# EAGLE design etchasketch (EAGLE 9.6.2)
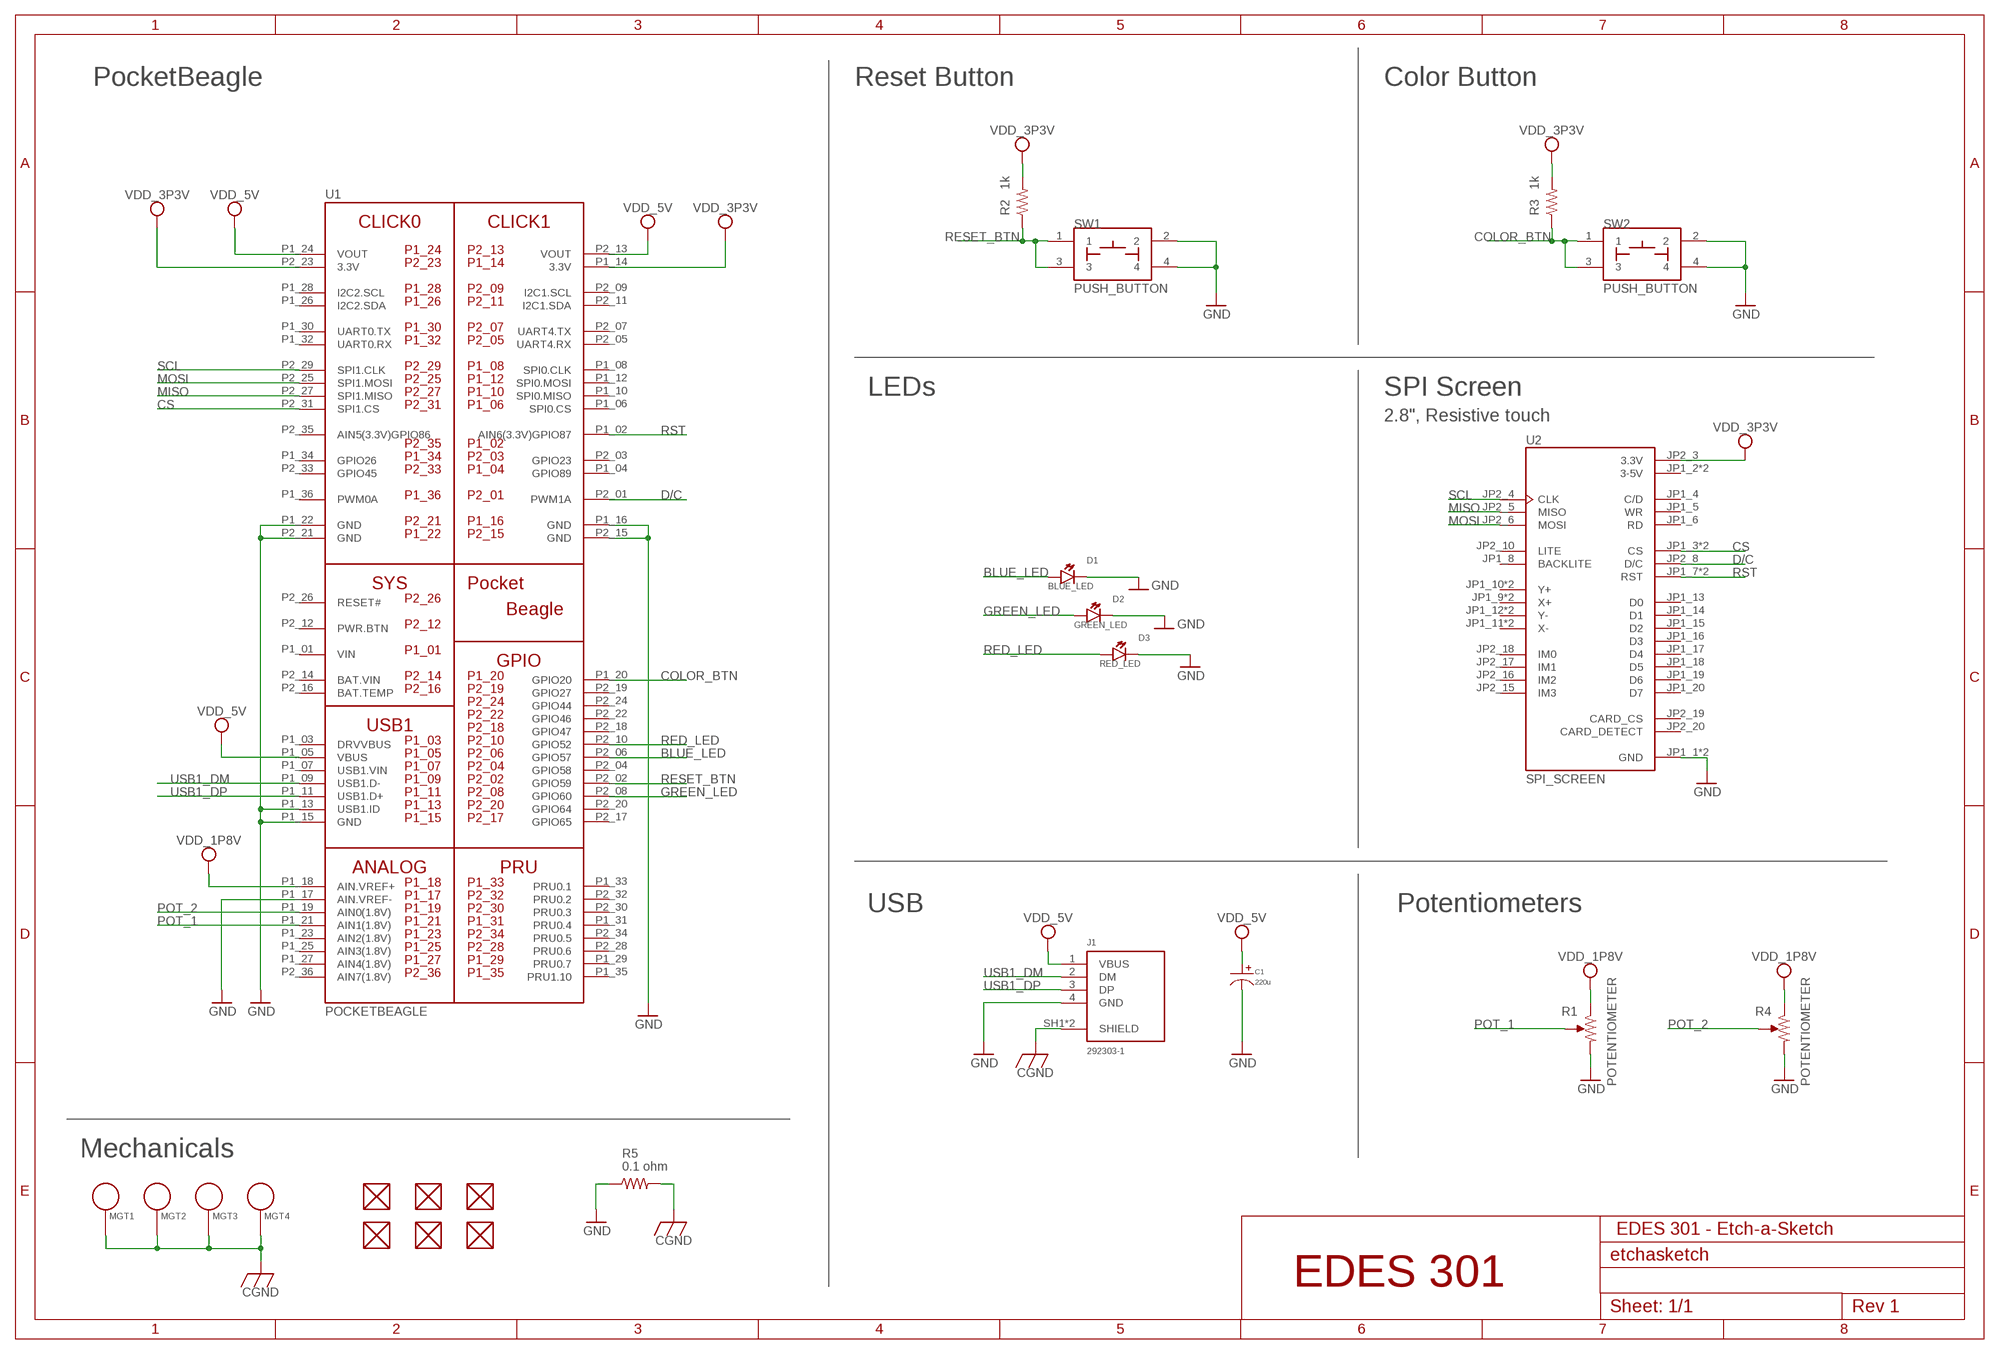
[diagram p0: schematic, sheet 1]

## Parts
C1  220u  CAPACITOR_P_10MM  [CP10MM]
D1  BLUE_LED  LED  [EIA-STD]
D2  GREEN_LED  LED  [EIA-STD]
D3  RED_LED  LED  [EIA-STD]
FUD1  FIDUCIAL  [FIDUCIAL_40MIL]
FUD2  FIDUCIAL  [FIDUCIAL_40MIL]
FUD3  FIDUCIAL  [FIDUCIAL_40MIL]
FUD4  FIDUCIAL  [FIDUCIAL_40MIL]
FUD5  FIDUCIAL  [FIDUCIAL_40MIL]
FUD6  FIDUCIAL  [FIDUCIAL_40MIL]
J1  292303-1  [TE_292303-1]
MGT1  MOUNTING_HOLE  [MOUNTING_HOLE]
MGT2  MOUNTING_HOLE  [MOUNTING_HOLE]
MGT3  MOUNTING_HOLE  [MOUNTING_HOLE]
MGT4  MOUNTING_HOLE  [MOUNTING_HOLE]
R1  POTENTIOMETER  [POT-PO90S]
R2  1k  R_R0603  [R0603]
R3  1k  R_R0603  [R0603]
R4  POTENTIOMETER  [POT-PO90S]
R5  0.1 ohm  R_R0805  [R0805]
SW1  PUSH_BUTTON  [BUTTON_12.5MM]
SW2  PUSH_BUTTON  [BUTTON_12.5MM]
U1  POCKETBEAGLE  [POCKETBEAGLE]
U2  SPI_SCREEN  [MODULE_1770]

## Nets
BLUE_LED: D1.ANODE U1.P2_06(GPIO57)
CGND: J1.SH1(SHIELD) J1.SH2(SHIELD) MGT1.P$1 MGT2.P$1 MGT3.P$1 MGT4.P$1 R5.2
COLOR_BTN: R3.1 SW2.1 SW2.3 U1.P1_20(GPIO20)
CS: U1.P2_31(SPI1.CS) U2.JP1_3(CS) U2.JP2_7(CS)
D/C: U1.P2_01(PWM1A) U2.JP2_8(D/C)
GND: C1.P$2 D1.CATHODE D2.CATHODE D3.CATHODE J1.4(GND) R1.CW R4.CW R5.1 SW1.2 SW1.4 SW2.2 SW2.4 U1.P1_13(USB1.ID) U1.P1_15(GND) U1.P1_16(GND) U1.P1_17(AIN.VREF-) U1.P1_22(GND) U1.P2_15(GND) U1.P2_21(GND) U2.JP1_1(GND) U2.JP2_1(GND)
GREEN_LED: D2.ANODE U1.P2_08(GPIO60)
MISO: U1.P2_27(SPI1.MISO) U2.JP2_5(MISO)
MOSI: U1.P2_25(SPI1.MOSI) U2.JP2_6(MOSI)
POT_1: R1.S U1.P1_21(AIN1(1.8V))
POT_2: R4.S U1.P1_19(AIN0(1.8V))
RED_LED: D3.ANODE U1.P2_10(GPIO52)
RESET_BTN: R2.1 SW1.1 SW1.3 U1.P2_02(GPIO59)
RST: U1.P1_02(AIN6(3.3V)GPIO87) U2.JP1_7(RST) U2.JP2_9(RST)
SCL: U1.P2_29(SPI1.CLK) U2.JP2_4(CLK)
USB1_DM: J1.2(DM) U1.P1_09(USB1.D-)
USB1_DP: J1.3(DP) U1.P1_11(USB1.D+)
VDD_1P8V: R1.CCW R4.CCW U1.P1_18(AIN.VREF+)
VDD_3P3V: R2.2 R3.2 U1.P1_14(3.3V) U1.P2_23(3.3V) U2.JP2_3(3.3V)
VDD_5V: C1.P$1 J1.1(VBUS) U1.P1_05(VBUS) U1.P1_24(VOUT) U1.P2_13(VOUT)
Unconnected: FUD1.P$1 FUD2.P$1 FUD3.P$1 FUD4.P$1 FUD5.P$1 FUD6.P$1 U1.P1_03(DRVVBUS) U1.P1_04(GPIO89) U1.P1_06(SPI0.CS) U1.P1_07(USB1.VIN) U1.P1_08(SPI0.CLK) U1.P1_10(SPI0.MISO) U1.P1_12(SPI0.MOSI) U1.P1_23(AIN2(1.8V)) U1.P1_25(AIN3(1.8V)) U1.P1_26(I2C2.SDA) U1.P1_27(AIN4(1.8V)) U1.P1_28(I2C2.SCL) U1.P1_29(PRU0.7) U1.P1_30(UART0.TX) U1.P1_31(PRU0.4) U1.P1_32(UART0.RX) U1.P1_33(PRU0.1) U1.P1_34(GPIO26) U1.P1_35(PRU1.10) U1.P1_36(PWM0A) U1.P2_03(GPIO23) U1.P2_04(GPIO58) U1.P2_05(UART4.RX) U1.P2_07(UART4.TX) U1.P2_09(I2C1.SCL) U1.P2_11(I2C1.SDA) U1.P2_12(PWR.BTN) U1.P2_16(BAT.TEMP) U1.P2_17(GPIO65) U1.P2_18(GPIO47) U1.P2_19(GPIO27) U1.P2_20(GPIO64) U1.P2_22(GPIO46) U1.P2_24(GPIO44) U1.P2_26(RESET#) U1.P2_28(PRU0.6) U1.P2_30(PRU0.3) U1.P2_32(PRU0.2) U1.P2_33(GPIO45) U1.P2_34(PRU0.5) U1.P2_35(AIN5(3.3V)GPIO86) U1.P2_36(AIN7(1.8V)) U2.JP1_4(C/D) U2.JP1_5(WR) U2.JP1_6(RD) U2.JP1_8(BACKLITE) U2.JP1_9(X+) U2.JP1_10(Y+) U2.JP1_11(X-) U2.JP1_12(Y-) U2.JP1_13(D0) U2.JP1_14(D1) U2.JP1_15(D2) U2.JP1_16(D3) U2.JP1_17(D4) U2.JP1_18(D5) U2.JP1_19(D6) U2.JP1_20(D7) U2.JP2_10(LITE) U2.JP2_11(Y+) U2.JP2_12(X+) U2.JP2_13(Y-) U2.JP2_14(X-) U2.JP2_15(IM3) U2.JP2_16(IM2) U2.JP2_17(IM1) U2.JP2_18(IM0) U2.JP2_19(CARD_CS) U2.JP2_20(CARD_DETECT)

## Notes on the sheet
- PocketBeagle | Reset Button | Color Button
- LEDs | SPI Screen
- 2.8", Resistive touch
- USB | Potentiometers
- Mechanicals
- EDES 301 - Etch-a-Sketch
- EDES 301
- 1/1

## Power pins joined to a net without a drawn wire
3-5V: U2.JP1_2(3-5V) U2.JP2_2(3-5V)
BAT.VIN: U1.P2_14(BAT.VIN)
VIN: U1.P1_01(VIN)

## Library data of the parts
C1 = etchasketch:CAPACITOR_P: Library: MF_Passives Description: Device for Polarized Capacitors. Manufacture part number (MPN), Voltage Rating, and Tolerance can be added via Attributes. Check https://factory.macrofab.com/parts for the house parts list.; POPULATE: 1
D1-D3 = etchasketch:LED: EIA-STD LED, LTST-C191TBKT
FUD1-FUD6 = combo_lock:FIDUCIAL
J1 = etchasketch:292303-1: Check availability <https://pricing.snapeda.com/parts/292303-1/TE%20Connectivity/view-part?ref=eda>; AVAILABILITY: In Stock; CENTERLINE_PITCH: 2 mm[.078 in]; CHECK_PRICES: https://www.snapeda.com/parts/292303-1/TE+Connectivity+AMP+Connectors/view-part/?ref=eda; COMMENT: 292303-1; DESCRIPTION: Type A Standard USB Connector 4 Position Right Angle Mount 1 Port | TE Connectivity 292303-1; EU_ROHS_COMPLIANCE: Compliant; MF: TE Connectivity; MP: 292303-1; NUMBER_OF_POSITIONS: 4; PACKAGE: None; PRICE: None; PRODUCT_TYPE: Connector; SNAPEDA_LINK: https://www.snapeda.com/parts/292303-1/TE+Connectivity+AMP+Connectors/view-part/?ref=snap
MGT1-MGT4 = combo_lock:MOUNTING_HOLE: Chassis Mounting Hole w/GND connection ability
R1 R4 = etchasketch:POTENTIOMETER: Potentiometer - Examples: P090S-14T20BR10K (987-1277-ND)
R2 R3 = etchasketch:R_: RESISTOR, American symbol. 1k
R5 = combo_lock:R_: RESISTOR, American symbol
SW1 SW2 = etchasketch:PUSH_BUTTON
U1 = etchasketch:POCKETBEAGLE
U2 = etchasketch:SPI_SCREEN: Check availability <https://pricing.snapeda.com/parts/1770/Adafruit%20Industries/view-part?ref=eda>; AVAILABILITY: In Stock; CHECK_PRICES: https://www.snapeda.com/parts/1770/Adafruit+Industries/view-part/?ref=eda; DESCRIPTION: 2.8 TFT LCD with Touchscreen Breakout Board w/MicroSD Socket | Adafruit Industries 1770; MF: Adafruit Industries; MP: 1770; PACKAGE: None; PRICE: None; SNAPEDA_LINK: https://www.snapeda.com/parts/1770/Adafruit+Industries/view-part/?ref=snap

## Board
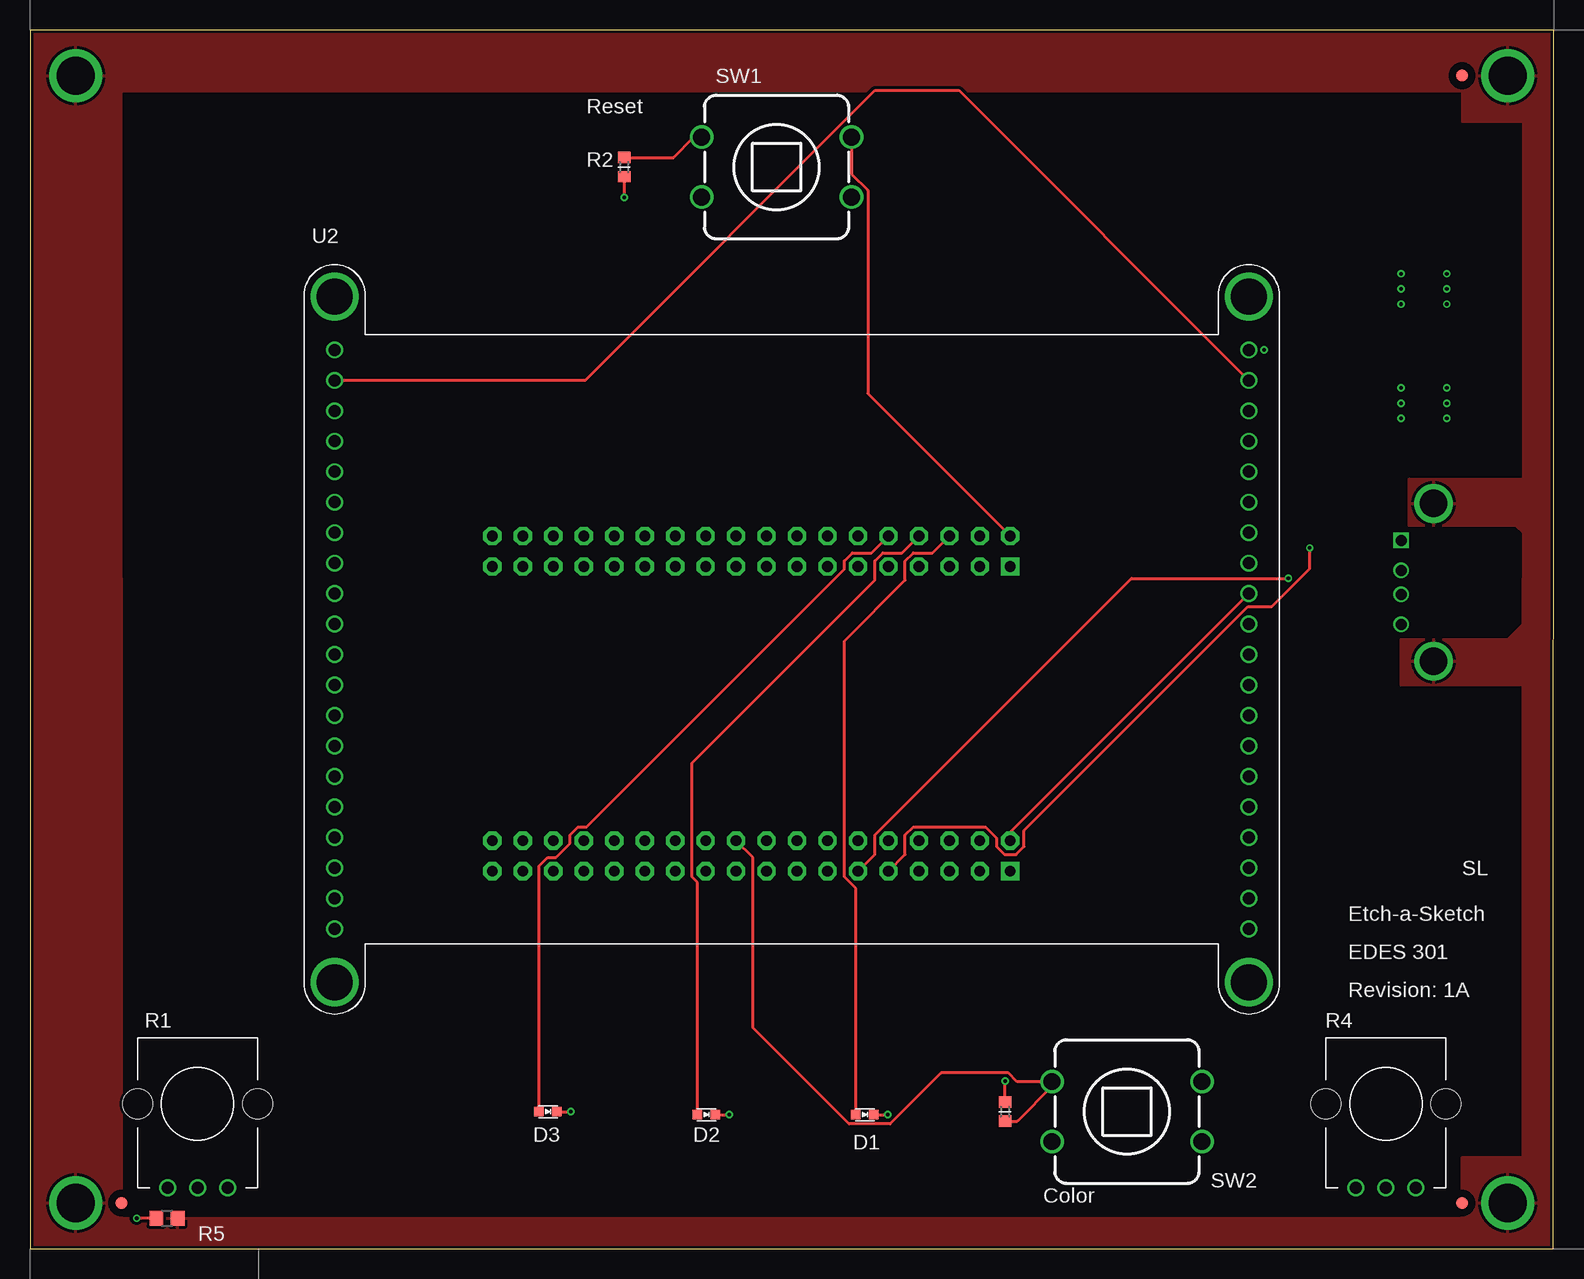
[diagram p1: board, top side]
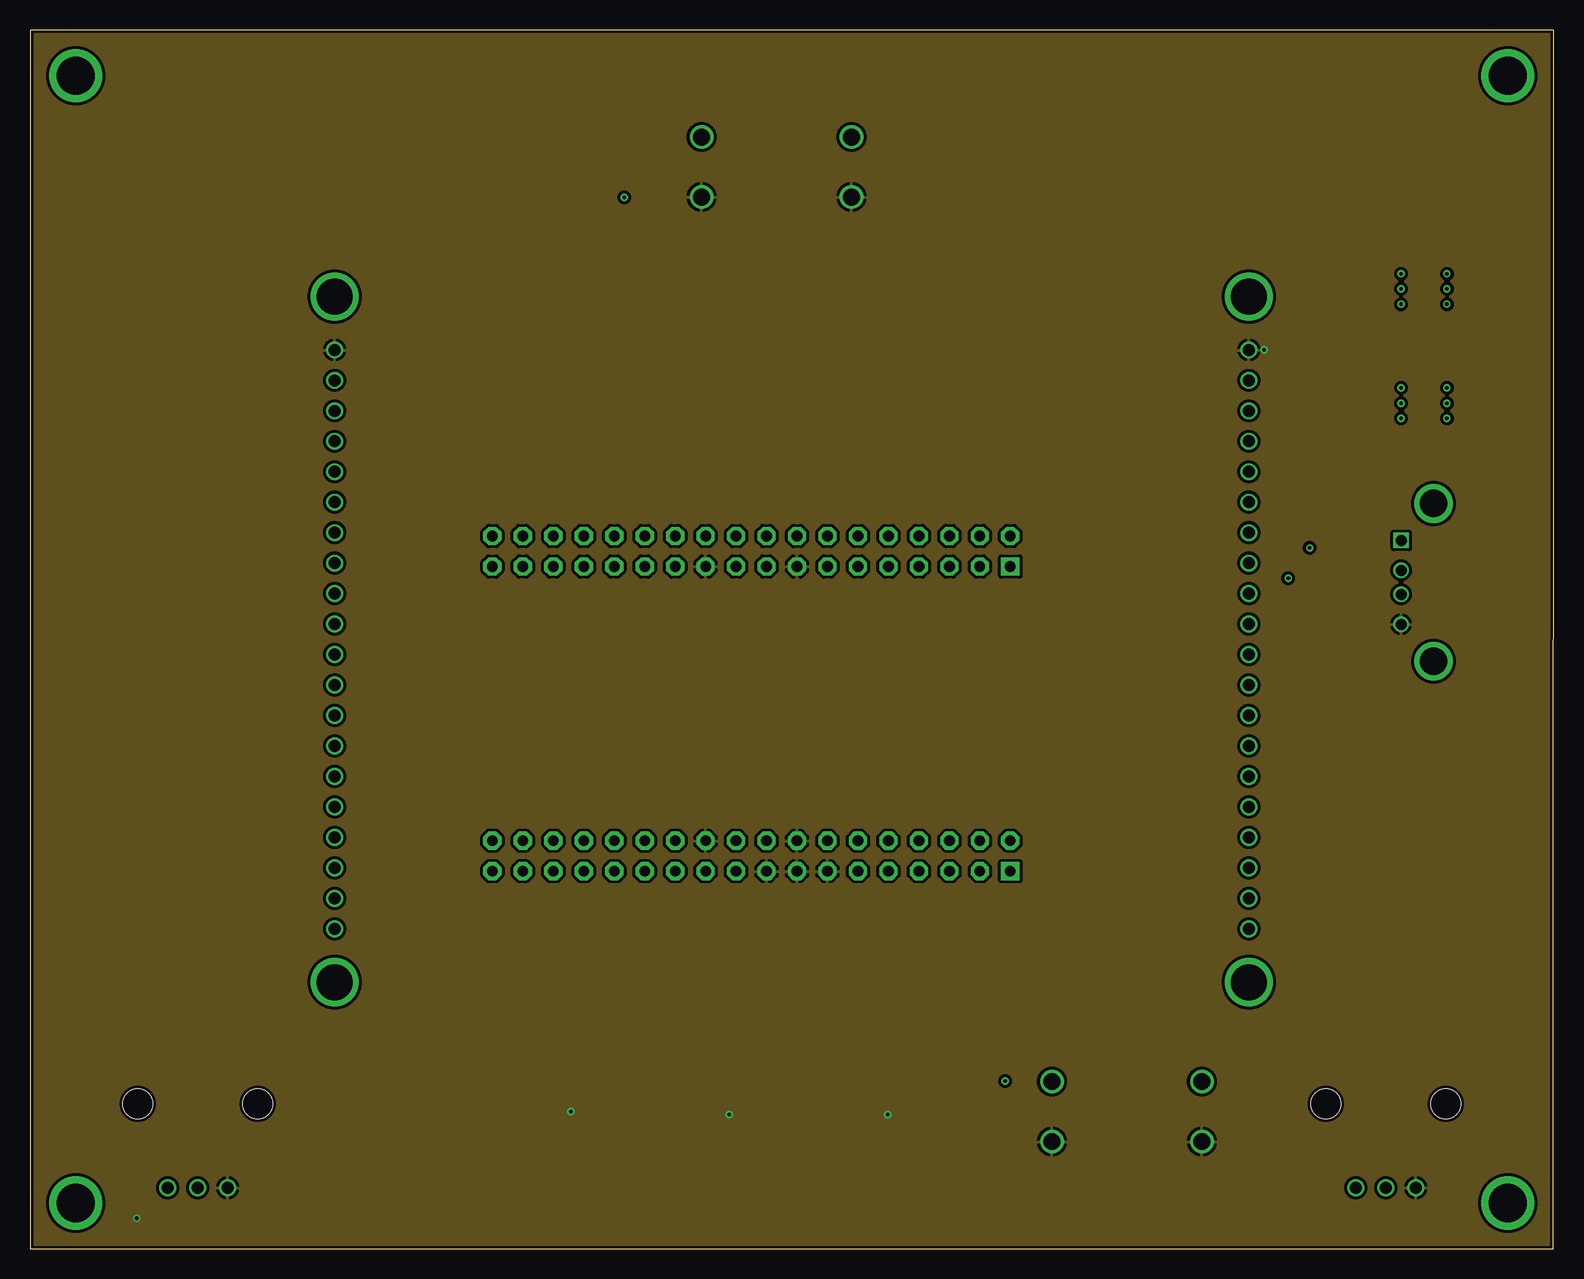
[diagram p2: board, inner layer Route2]
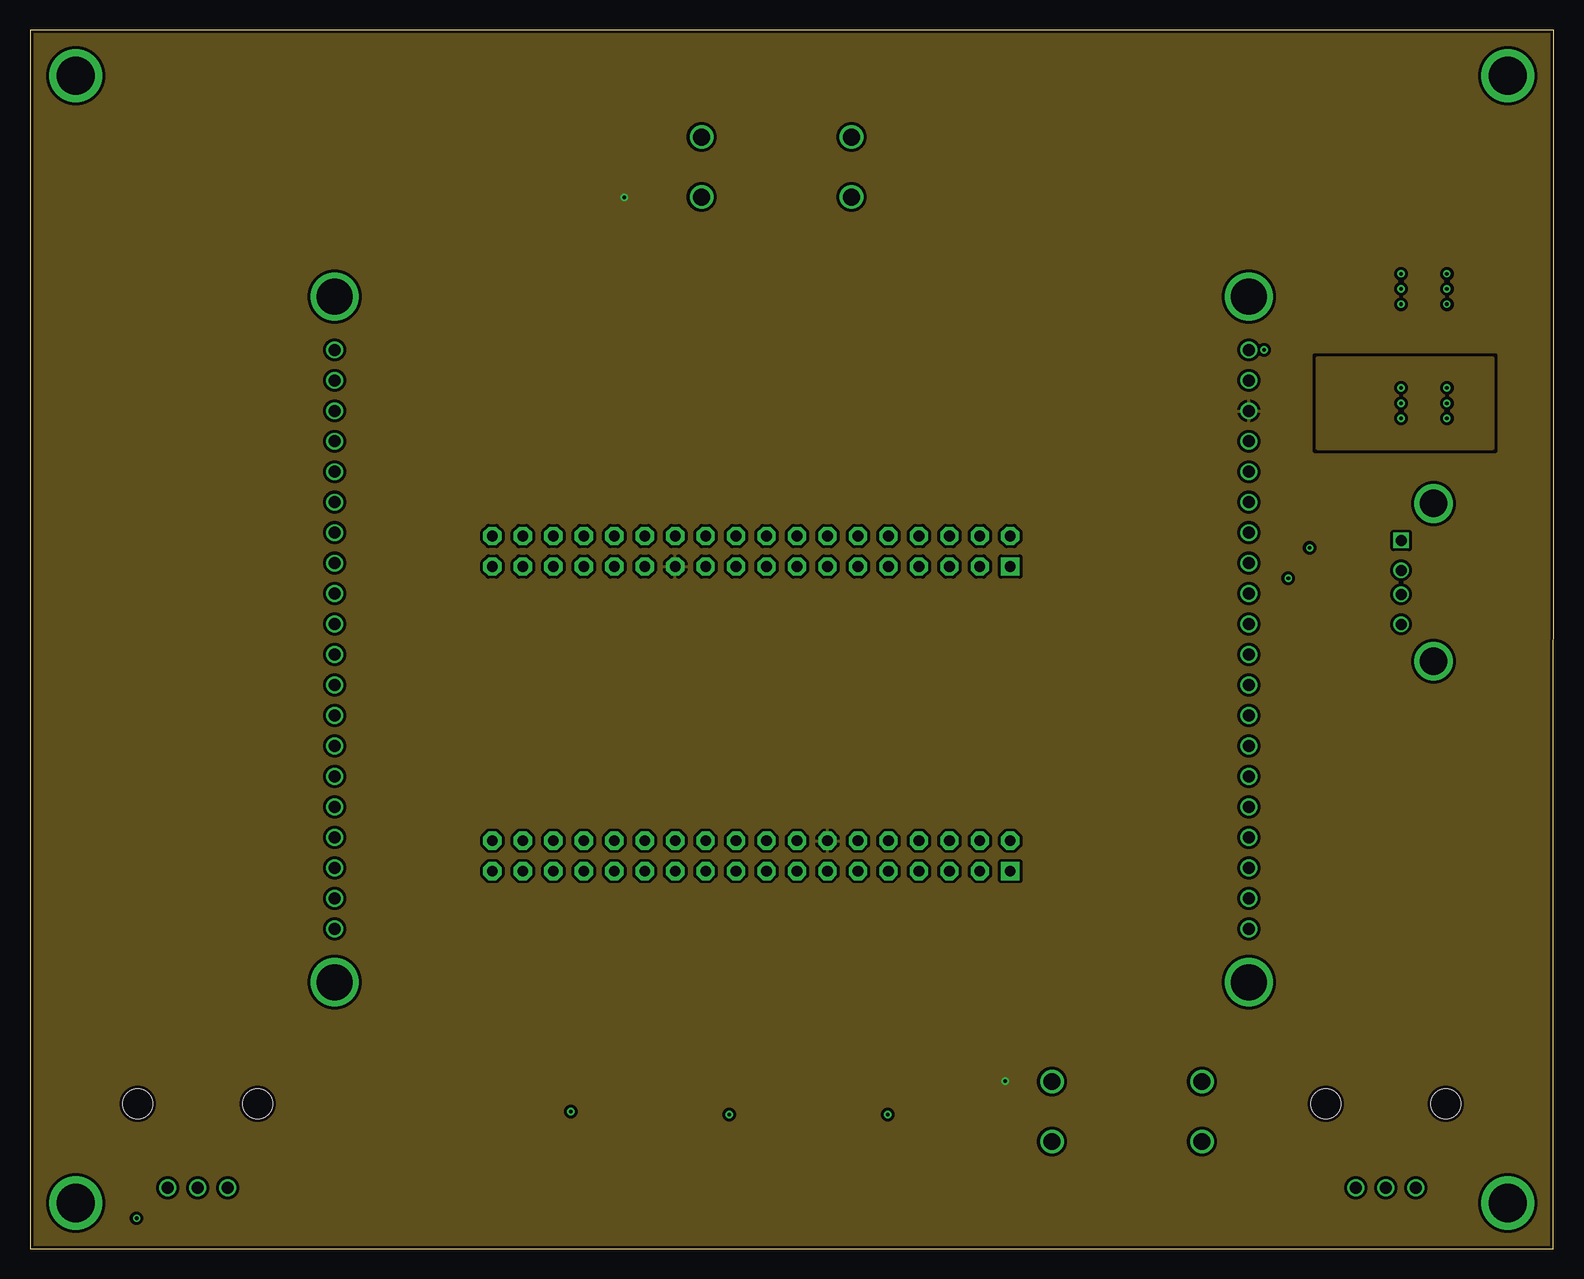
[diagram p3: board, inner layer Route15]
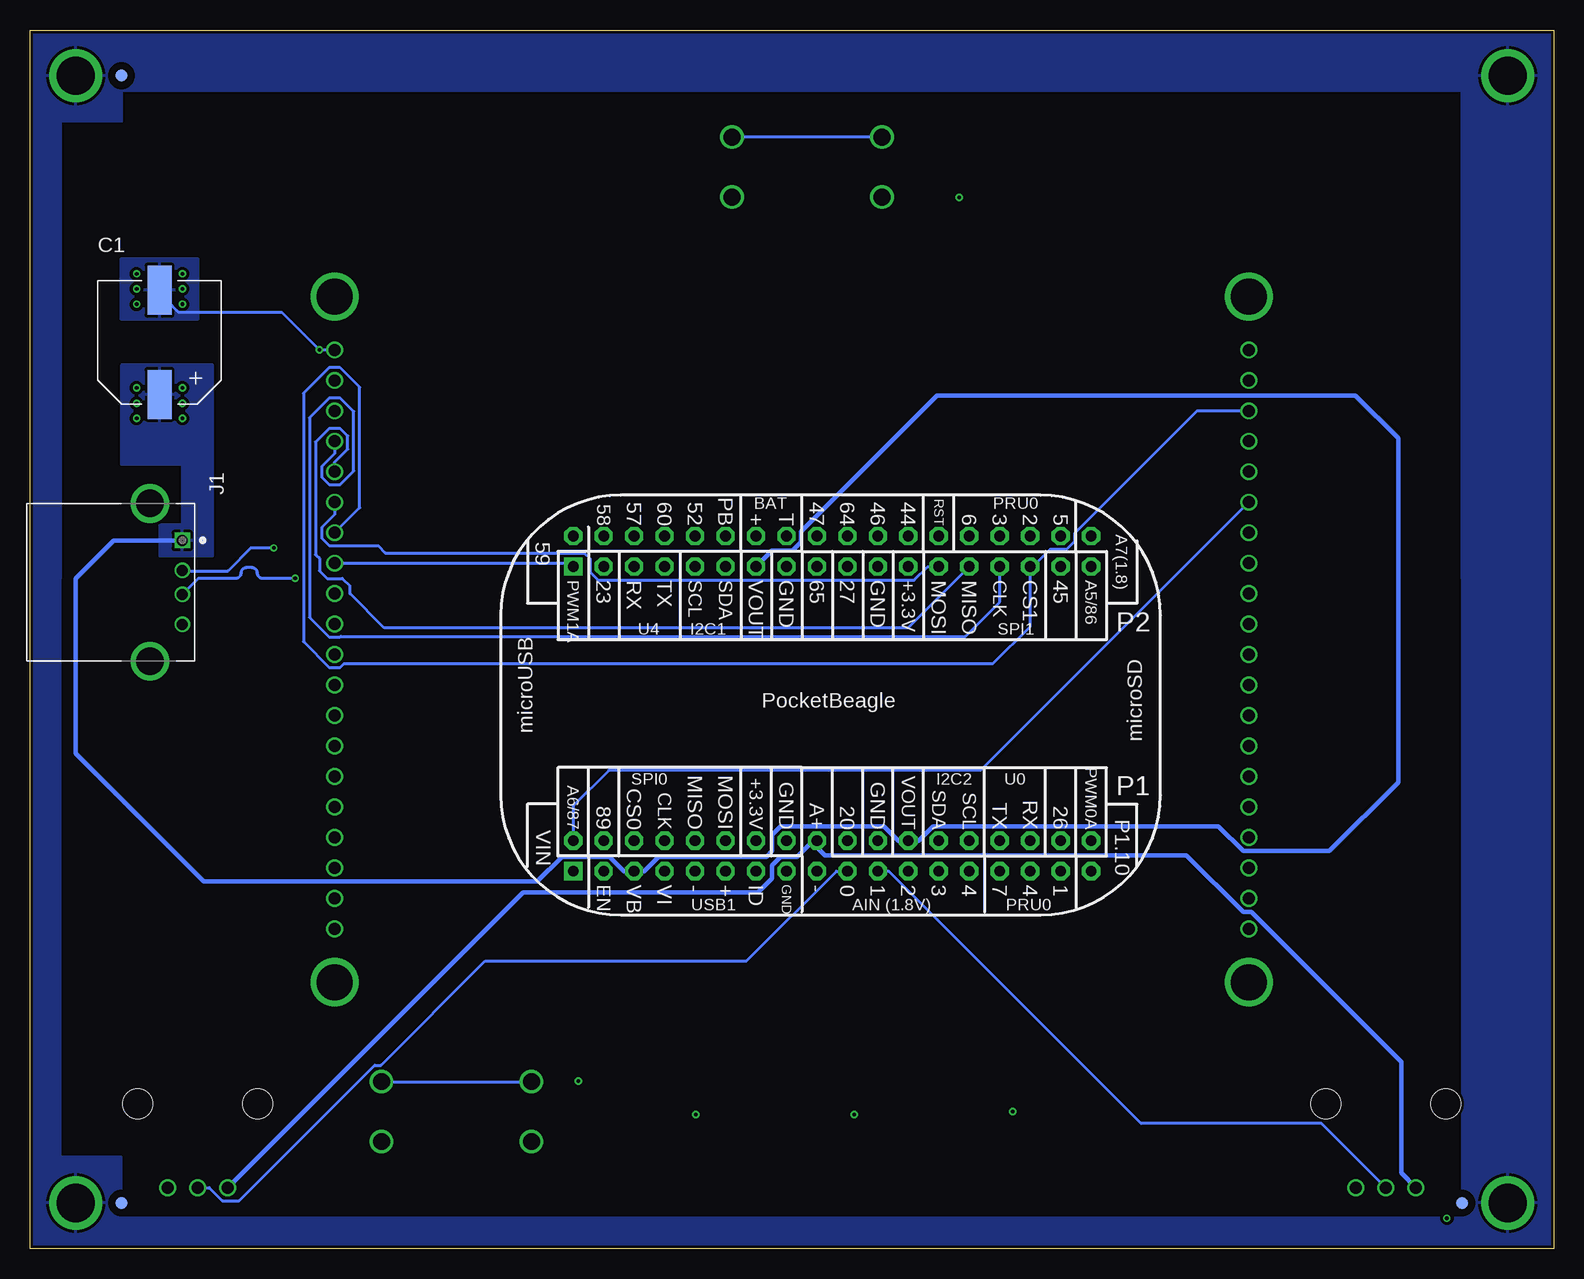
[diagram p4: board, bottom side, seen from below]

Size 127 x 101.6 mm. Coordinates in mm from the lower left corner, seen from the top.
Outline: 0,0 126.98,0 127,101.6 0,101.6 0,0
Copper layers (1*2*15*16): Top 0.035mm / dielectric 0.23mm / Route2 0.035mm / dielectric 0.93mm / Route15 0.035mm / dielectric 0.23mm / Bottom 0.035mm
Design rules "ENGI301_4lyr": minimum track width 10mil, minimum drill 12mil, track to track 10mil, track to pad 10mil, pad to pad 10mil, via to via 10mil, smd to smd 10mil, copper to edge 10mil, drill to drill 12mil, minimum pad ring 6mil, minimum via ring 6mil, stop-mask expansion 3mil, vias tented up to drill 25mil, thermal gap 10mil

### Footprints (pad centres in the part's own frame; a part is rotated, then mirrored left to right if it is on the bottom)
CP10MM = smd 2 x 4.1: P$1 0,-4.35; P$2 0,4.35
EIA-STD = smd 0.8 x 0.8: ANODE -0.75,0; CATHODE 0.75,0
FIDUCIAL_40MIL = smd 1.016 x 1.016: P$1 0,0
TE_292303-1 = drill 0.92 square: 1 0,0 | drill 0.92: 2 2.5,0; 3 4.5,0; 4 7,0 | drill 2.3: SH1 -3.07,-2.71; SH2 10.07,-2.71
MOUNTING_HOLE = drill 3.175 pad 4.445: P$1 0,0
POT-PO90S = drill 1: CCW -2.5,0; CW 2.5,0; S 0,0 | hole 2.5: -5,7; 5,7
R0603 = smd 0.95 x 1.031: 1 -0.8,0; 2 0.8,0
R0805 = smd 1.143 x 1.27: 1 -0.889,0; 2 0.889,0
BUTTON_12.5MM = drill 1.4: 1 -6.25,2.5; 2 -6.25,-2.5; 3 6.25,2.5; 4 6.25,-2.5
POCKETBEAGLE = drill 0.889 pad 1.524 square: P1_01 5.91,3.53; P2_01 5.91,28.93 | drill 0.889 pad 1.524 octagon: P1_02 5.91,6.07; P1_03 8.45,3.53; P1_04 8.45,6.07; P1_05 10.99,3.53; P1_06 10.99,6.07; P1_07 13.53,3.53; P1_08 13.53,6.07; P1_09 16.07,3.53; P1_10 16.07,6.07; P1_11 18.61,3.53; P1_12 18.61,6.07; P1_13 21.15,3.53; P1_14 21.15,6.07; P1_15 23.69,3.53; P1_16 23.69,6.07; P1_17 26.23,3.53; P1_18 26.23,6.07; P1_19 28.77,3.53; P1_20 28.77,6.07; P1_21 31.31,3.53; P1_22 31.31,6.07; P1_23 33.85,3.53; P1_24 33.85,6.07; P1_25 36.39,3.53; P1_26 36.39,6.07; P1_27 38.93,3.53; P1_28 38.93,6.07; P1_29 41.47,3.53; P1_30 41.47,6.07; P1_31 44.01,3.53; P1_32 44.01,6.07; P1_33 46.55,3.53; P1_34 46.55,6.07; P1_35 49.09,3.53; P1_36 49.09,6.07; P2_02 5.91,31.47; P2_03 8.45,28.93; P2_04 8.45,31.47; P2_05 10.99,28.93; P2_06 10.99,31.47; P2_07 13.53,28.93; P2_08 13.53,31.47; P2_09 16.07,28.93; P2_10 16.07,31.47; P2_11 18.61,28.93; P2_12 18.61,31.47; P2_13 21.15,28.93; P2_14 21.15,31.47; P2_15 23.69,28.93; P2_16 23.69,31.47; P2_17 26.23,28.93; P2_18 26.23,31.47; P2_19 28.77,28.93; P2_20 28.77,31.47; P2_21 31.31,28.93; P2_22 31.31,31.47; P2_23 33.85,28.93; P2_24 33.85,31.47; P2_25 36.39,28.93; P2_26 36.39,31.47; P2_27 38.93,28.93; P2_28 38.93,31.47; P2_29 41.47,28.93; P2_30 41.47,31.47; P2_31 44.01,28.93; P2_32 44.01,31.47; P2_33 46.55,28.93; P2_34 46.55,31.47; P2_35 49.09,28.93; P2_36 49.09,31.47
MODULE_1770 = drill 1: JP1_1 24.13,38.1; JP1_2 21.59,38.1; JP1_3 19.05,38.1; JP1_4 16.51,38.1; JP1_5 13.97,38.1; JP1_6 8.89,38.1; JP1_7 11.43,38.1; JP1_8 6.35,38.1; JP1_9 3.81,38.1; JP1_10 1.27,38.1; JP1_11 -3.81,38.1; JP1_12 -1.27,38.1; JP1_13 -6.35,38.1; JP1_14 -8.89,38.1; JP1_15 -11.43,38.1; JP1_16 -16.51,38.1; JP1_17 -13.97,38.1; JP1_18 -19.05,38.1; JP1_19 -21.59,38.1; JP1_20 -24.13,38.1; JP2_1 24.13,-38.1; JP2_2 21.59,-38.1; JP2_3 19.05,-38.1; JP2_4 16.51,-38.1; JP2_5 13.97,-38.1; JP2_6 11.43,-38.1; JP2_7 8.89,-38.1; JP2_8 6.35,-38.1; JP2_9 3.81,-38.1; JP2_10 1.27,-38.1; JP2_11 -1.27,-38.1; JP2_12 -3.81,-38.1; JP2_13 -6.35,-38.1; JP2_14 -8.89,-38.1; JP2_15 -11.43,-38.1; JP2_16 -13.97,-38.1; JP2_17 -16.51,-38.1; JP2_18 -19.05,-38.1; JP2_19 -21.59,-38.1; JP2_20 -24.13,-38.1 | drill 3: SH1 -28.575,38.1; SH2 28.575,38.1; SH3 -28.575,-38.1; SH4 28.575,-38.1

### Placement (x,y rotation side)
C1  116.2,75.56 0 bottom
D1  69.6,11.18 0 top
D2  56.39,11.18 0 top
D3  43.18,11.43 0 top
FUD1  119.38,3.81 0 top
FUD2  7.62,3.81 0 top
FUD3  119.38,97.79 0 top
FUD4  7.62,3.81 0 bottom
FUD5  119.38,3.81 0 bottom
FUD6  119.38,97.79 0 bottom
J1  114.3,59.05 270 bottom
MGT1  3.81,3.81 0 top
MGT2  3.81,97.79 0 top
MGT3  123.19,97.79 0 top
MGT4  123.19,3.81 0 top
R1  13.97,5.08 0 top
R2  49.53,90.17 270 top
R3  81.28,11.43 90 top
R4  113.03,5.08 0 top
R5  11.43,2.54 0 top
SW1  62.23,90.17 0 top
SW2  91.44,11.43 0 top
U1  87.63,27.94 0 bottom
U2  63.5,50.8 90 top

### Tracks (layer width: path | path; a pad name or v marks a point on that pad's centre or on a via)
3-5V
  Top 0.254: U2.JP1_2 46.27,72.39 70.46,96.57 77.42,96.57 U2.JP2_2
BLUE_LED
  Top 0.254: D1.ANODE 68.85,30.03 67.88,31 67.88,50.65 72.96,55.73 72.96,57.34 73.63,58.01 75.24,58.01 U1.P2_06
CGND
  pour Top: -2.54,55.88 7.62,55.88 7.62,2.54 119.38,2.54 119.38,7.62 124.46,7.62 124.46,46.99 114.3,46.99 114.3,50.8 123.19,50.8 124.46,52.07 124.46,55.88 129.54,55.88 129.54,-2.54 -2.54,-2.54
  pour Top: -2.54,55.88 7.62,55.88 7.62,96.52 119.38,96.52 119.38,93.98 124.46,93.98 124.46,64.14 114.94,64.14 114.94,60.33 123.83,60.33 124.46,59.69 124.46,55.88 129.54,55.88 129.54,104.14 -2.54,104.14
  pour Bottom: -2.54,55.88 7.62,55.88 7.62,27.94 7.62,2.54 119.38,2.54 119.38,7.62 124.46,7.62 124.46,55.88 129.54,55.88 129.54,-2.54 -2.54,-2.54
  pour Bottom: -2.54,55.88 7.62,55.88 7.62,96.52 119.38,96.52 119.38,93.98 124.46,93.98 124.46,62.87 124.46,55.88 129.54,55.88 129.54,104.14 -2.54,104.14
COLOR_BTN
  Top 0.254: R3.1 82.3,10.63 85.24,13.57 85.24,13.88 SW2.1 82.29,13.93 81.56,14.66 75.95,14.66 71.69,10.39 68.29,10.39 60.26,18.43 60.26,32.61 U1.P1_20
  Bottom 0.254: SW2.3 SW2.1
CS
  Bottom 0.254: U2.JP2_7 99.5,61.79 99.5,71.82 101.15,73.47 102.05,73.47 104.2,71.31 104.2,50.61 102.05,48.45 101.15,48.45 100.83,48.77 46.74,48.77 43.62,51.88 43.62,56.64 | 43.62,56.64 U1.P2_31 | 43.62,56.64 41.99,58.27 40.61,58.27 39.94,58.94 39.94,59.63 29.72,69.85 U2.JP1_3
D/C
  Bottom 0.254: U2.JP2_8 82,57.15 U1.P2_01
GND  (via drill 0.3 pad 0.61)
  Top 0.254: D1.CATHODE v71.5,11.18 | D2.CATHODE v58.29,11.18 | D3.CATHODE v45.09,11.43 | R5.1 v8.89,2.54
  Bottom 0.254: U2.JP2_1 v102.87,74.93 105.99,78.05 114.58,78.05 115.57,79.04 115.57,79.38 116.11,79.92 C1.P$2
  pour Route2 (rank 6): -5.08,-2.54 -5.08,109.22 134.62,109.22 134.62,-2.54
  pour Bottom: 113.03,82.55 113.03,77.47 119.38,77.47 119.38,82.55
  pour Route2: 113.03,82.55 113.03,77.47 119.38,77.47 119.38,82.55
GREEN_LED
  Top 0.254: D2.ANODE 55.64,30.54 55.18,31 55.18,40.49 70.42,55.73 70.42,57.34 71.09,58.01 72.7,58.01 U1.P2_08
MISO
  Bottom 0.254: U2.JP2_5 101.6,65.58 100.52,66.66 100.52,67.76 101.15,68.39 102.05,68.39 103.19,67.25 103.19,57.84 102.87,57.53 102.87,56.52 102.23,55.88 100.97,55.88 100.33,55.24 100.33,54.61 97.47,51.75 53.82,51.75 U1.P2_27
MOSI
  Bottom 0.254: U1.P2_25 52.16,56.87 53.31,55.73 79.65,55.73 80.32,56.4 80.32,57.54 80.8,58.01 97.38,58.01 97.98,58.61 102.05,58.61 102.68,59.24 102.68,60.14 101.6,61.22 U2.JP2_6
N$1  (via drill 0.3 pad 0.61)
  other vias: 114.3,81.28
N$2  (via drill 0.3 pad 0.61)
  other vias: 114.3,80.01
N$3  (via drill 0.3 pad 0.61)
  other vias: 114.3,78.74
N$4  (via drill 0.3 pad 0.61)
  other vias: 118.11,81.28
N$5  (via drill 0.3 pad 0.61)
  other vias: 118.11,80.01
N$6  (via drill 0.3 pad 0.61)
  other vias: 118.11,78.74
N$7  (via drill 0.3 pad 0.61)
  other vias: 114.3,71.75
N$8  (via drill 0.3 pad 0.61)
  other vias: 114.3,70.48
N$9  (via drill 0.3 pad 0.61)
  other vias: 114.3,69.22
N$10  (via drill 0.3 pad 0.61)
  other vias: 118.11,71.75
N$11  (via drill 0.3 pad 0.61)
  other vias: 118.11,70.48
N$12  (via drill 0.3 pad 0.61)
  other vias: 118.11,69.22
POT_1
  Bottom 0.254: R1.S 19.34,10.45 34.38,10.45 55.4,31.47 U1.P1_21
POT_2
  Bottom 0.254: R4.S 112.06,5.08 110.98,4 109.55,4 98.25,15.29 97.74,15.29 89.05,23.98 67.28,23.98 59.78,31.47 U1.P1_19
RED_LED
  Top 0.254: U1.P2_10 70.16,58.01 68.55,58.01 67.88,57.34 67.88,56.65 46.38,35.15 45.69,35.15 45.02,34.48 45.02,33.79 43.84,32.61 43.15,32.61 42.43,31.9 D3.ANODE
RESET_BTN
  Top 0.254: SW1.3 68.48,89.59 69.84,88.23 69.84,71.29 U1.P2_02 | R2.1 53.63,90.97 55.37,92.71 55.94,92.71 SW1.1
  Bottom 0.254: SW1.1 SW1.3
RST
  Top 0.254: U1.P1_02 81.72,34.73 U2.JP2_9
  Bottom 0.254: U2.JP1_7 47.75,39.88 78.74,39.88 81.72,36.9 U1.P1_02
SCL
  Bottom 0.254: U2.JP2_4 101.6,66.3 102.68,65.22 102.68,64.32 102.05,63.69 101.15,63.69 100.01,64.83 100.01,69.79 101.15,70.93 102.05,70.93 103.7,69.28 103.7,52.64 102.05,50.99 101.15,50.99 101.09,51.05 49.02,51.05 46.16,53.92 U1.P2_29
USB1_DM  (via drill 0.3 pad 0.61)
  Top 0.254: U1.P1_09 72.96,32.87 72.96,34.48 73.63,35.15 79.65,35.15 80.58,34.23 80.58,33.54 81.25,32.87 82.19,32.87 82.86,33.54 82.86,34.86 101.53,53.53 103.51,53.53 106.68,56.7 v106.68,58.42
  Bottom 0.254: v106.68,58.42 108.58,58.42 110.49,56.52 114.26,56.52 J1.2
USB1_DP  (via drill 0.3 pad 0.61)
  Top 0.254: U1.P1_11 70.42,32.87 70.42,34.48 91.81,55.88 v104.89,55.88
  Bottom 0.254: v104.89,55.88 107.6,55.88 arc90 108.05,56.33 arc-90 108.49,56.77 108.97,56.77 arc-90 109.41,56.33 arc90 109.86,55.88 112.97,55.88 J1.3
VDD_1P8V
  Bottom 0.381: R1.CCW 12.7,6.31 12.7,15.59 25.18,28.07 25.87,28.07 30.61,32.8 60.74,32.8 61.4,33.46 U1.P1_18 61.72,34.01 63.06,32.68 64.44,32.68 65.15,31.97 65.15,30.87 66.29,29.72 85.89,29.72 R4.CCW
VDD_3P3V  (via drill 0.3 pad 0.61)
  Top 0.254: R2.2 v49.53,87.63 | R3.2 v81.28,13.97
  pour Route15 (rank 6): -10.16,-2.54 -10.16,114.3 142.24,114.3 142.24,-7.62 -10.16,-7.62
VDD_5V
  Bottom 0.381: U1.P2_13 65.15,58.2 63.44,58.2 62.73,58.91 62.73,59.78 51.4,71.12 16.51,71.12 12.95,67.56 12.95,38.86 18.67,33.15 25.87,33.15 27.95,35.22 51.74,35.22 52.95,34.01 U1.P1_24 54.61,34.01 55.82,35.22 64.44,35.22 65.15,34.51 65.15,33.15 65.62,32.68 74.6,32.68 75.81,31.47 U1.P1_05 77.47,31.47 78.68,32.68 82.67,32.68 84.74,30.61 112.52,30.61 123.19,41.27 123.19,55.88 120.02,59.05 J1.1
  pour Route15: 107.31,74.3 121.92,74.3 121.92,66.67 107.31,66.67
  pour Bottom: 113.67,73.66 119.38,73.66 119.38,65.41 114.3,65.41 114.3,60.33 116.2,60.33 116.2,58.42 116.2,57.78 111.76,57.78 111.76,73.66

### Text on the board
tPlace: Reset | SL | Etch-a-Sketch | EDES 301 | Revision: 1A | Color
tNames: SW1 | R2 | U2 | R1 | R4 | D3 | D2 | D1 | SW2 | R5